# Altium schematic sheet TP_IHM_BUZZER.SchDoc
size A4
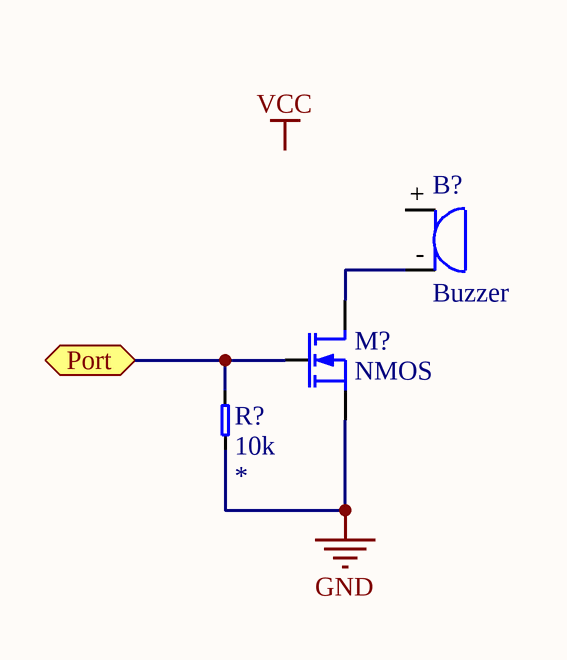
[diagram p0: TP_IHM_BUZZER.SchDoc]

## Parts
B?  Buzzer  [SD160709]
M?  NMOS  [MOSFET-SOT23]
R?  value 10k  [0603_RES_LD]  (hidden comment: Resistor)

## Ports
Port

## Nets
GND: M?.S R?.1
Port: M?.G R?.2 ; port Port
NetB?_-: B?.- M?.D

Not connected (* = marked no-connect by the designer): B? +

## Notes on the sheet
- Labels drawn without touching a wire or pin: VCC

## Library data of the parts
B? = SD160709: TDK SD160709 Buzzer; Reference: SD160709
M? = N-MOSFET: N MOSFET
R? = Resistor: Precision: *; Package: *